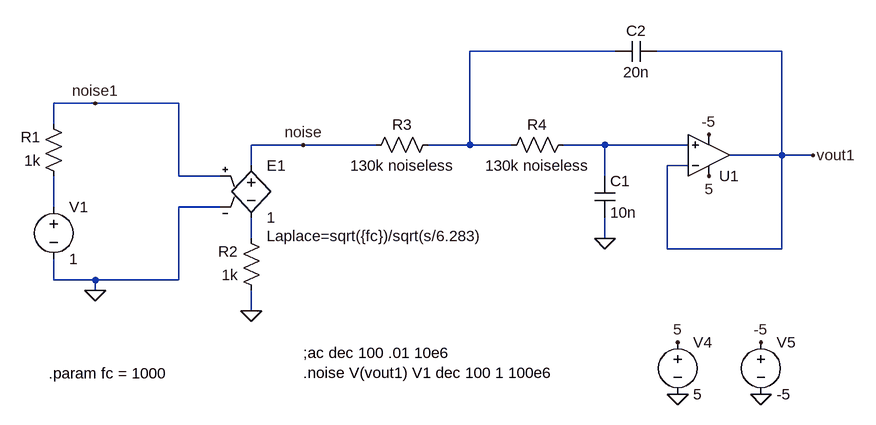
[diagram p0: schematic butterworth_and_1_over_f_noise.asc]
butterworth_and_1_over_f_noise.asc, the LTspice schematic file:
Version 4
SHEET 1 2532 680
WIRE 1008 -16 784 -16
WIRE 1264 -16 1072 -16
WIRE 208 64 144 64
WIRE 336 64 208 64
WIRE 144 96 144 64
WIRE 528 128 448 128
WIRE 640 128 528 128
WIRE 784 128 784 -16
WIRE 784 128 720 128
WIRE 848 128 784 128
WIRE 992 128 928 128
WIRE 1120 128 992 128
WIRE 1264 144 1264 -16
WIRE 1264 144 1184 144
WIRE 1312 144 1264 144
WIRE 448 160 448 128
WIRE 1120 160 1088 160
WIRE 336 176 336 64
WIRE 400 176 336 176
WIRE 992 176 992 128
WIRE 144 224 144 176
WIRE 400 224 336 224
WIRE 448 272 448 240
WIRE 992 272 992 240
WIRE 1088 288 1088 160
WIRE 1264 288 1264 144
WIRE 1264 288 1088 288
WIRE 144 336 144 304
WIRE 208 336 144 336
WIRE 336 336 336 224
WIRE 336 336 208 336
WIRE 208 352 208 336
WIRE 448 384 448 352
FLAG 208 352 0
FLAG 208 64 noise1
FLAG 528 128 noise
FLAG 448 384 0
FLAG 1152 176 5
FLAG 1152 112 -5
FLAG 992 272 0
FLAG 1312 144 vout1
FLAG 1104 432 5
FLAG 1232 432 -5
FLAG 1104 512 0
FLAG 1232 512 0
SYMBOL res 160 192 R180
WINDOW 0 36 76 Left 2
WINDOW 3 36 40 Left 2
SYMATTR InstName R1
SYMATTR Value 1k
SYMBOL e 448 144 R0
WINDOW 123 24 124 Left 2
SYMATTR Value2 Laplace=sqrt({fc})/sqrt(s/6.283)
SYMATTR InstName E1
SYMATTR Value 1
SYMBOL voltage 144 208 R0
WINDOW 123 0 0 Left 0
WINDOW 39 0 0 Left 0
SYMATTR InstName V1
SYMATTR Value 1
SYMBOL res 464 368 R180
WINDOW 0 36 76 Left 2
WINDOW 3 36 40 Left 2
SYMATTR InstName R2
SYMATTR Value 1k
SYMBOL Opamps\\UniversalOpamp2 1152 144 M180
SYMATTR InstName U1
SYMATTR Value2 Avol=10Meg GBW=10Meg Slew=10Meg
SYMBOL cap 976 176 R0
SYMATTR InstName C1
SYMATTR Value 10n
SYMBOL cap 1072 -32 R90
WINDOW 0 0 32 VBottom 2
WINDOW 3 32 32 VTop 2
SYMATTR InstName C2
SYMATTR Value 20n
SYMBOL res 736 112 R90
WINDOW 0 0 56 VBottom 2
WINDOW 3 32 56 VTop 2
SYMATTR InstName R3
SYMATTR Value 130k noiseless
SYMBOL res 944 112 R90
WINDOW 0 0 56 VBottom 2
WINDOW 3 32 56 VTop 2
SYMATTR InstName R4
SYMATTR Value 130k noiseless
SYMBOL voltage 1104 416 R0
WINDOW 123 0 0 Left 0
WINDOW 39 0 0 Left 0
SYMATTR InstName V4
SYMATTR Value 5
SYMBOL voltage 1232 416 R0
WINDOW 123 0 0 Left 0
WINDOW 39 0 0 Left 0
SYMATTR InstName V5
SYMATTR Value -5
TEXT 136 480 Left 2 !.param fc = 1000
TEXT 528 448 Left 2 !;ac dec 100 .01 10e6\n.noise V(vout1) V1 dec 100 1 100e6

The netlist it stands for:
* butterworth_and_1_over_f_noise.asc
R1 N003 noise1 1k
E1 noise N004 noise1 0 1 Laplace=sqrt({fc})/sqrt(s/6.283)
V1 N003 0 1
R2 0 N004 1k
XU1 N002 vout1 5 -5 vout1 level.2 Avol=10Meg GBW=10Meg Slew=10Meg ilimit=25m rail=0 Vos=0 phimargin=45 en=0 enk=0 in=0 ink=0 Rin=500Meg  ; pins IN+ IN- V+ V- OUT
C1 N002 0 10n
C2 vout1 N001 20n
R3 N001 noise 130k noiseless
R4 N002 N001 130k noiseless
V4 5 0 5
V5 -5 0 -5
.param fc = 1000
;ac dec 100 .01 10e6
.noise V(vout1) V1 dec 100 1 100e6
.lib UniversalOpamps2.sub
.backanno
.end